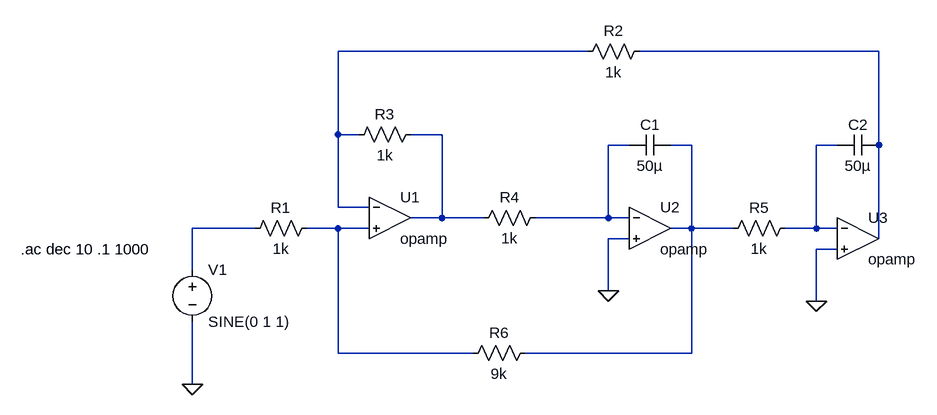
[diagram p0: schematic schem.asc]
schem.asc, the LTspice schematic file:
Version 4
SHEET 1 1240 680
WIRE 224 -96 -160 -96
WIRE 672 -96 304 -96
WIRE -160 32 -160 -96
WIRE -128 32 -160 32
WIRE 0 32 -48 32
WIRE 288 48 256 48
WIRE 384 48 352 48
WIRE 608 48 576 48
WIRE 672 48 672 -96
WIRE -160 144 -160 32
WIRE -112 144 -160 144
WIRE 0 160 0 32
WIRE 0 160 -48 160
WIRE 64 160 0 160
WIRE 256 160 256 48
WIRE 256 160 144 160
WIRE 288 160 256 160
WIRE -288 176 -384 176
WIRE -160 176 -208 176
WIRE -112 176 -160 176
WIRE 384 176 384 48
WIRE 384 176 352 176
WIRE 448 176 384 176
WIRE 576 176 576 48
WIRE 576 176 528 176
WIRE 608 176 576 176
WIRE 288 192 256 192
WIRE 672 192 672 48
WIRE 608 208 576 208
WIRE -384 240 -384 176
WIRE 256 272 256 192
WIRE 576 288 576 208
WIRE -160 368 -160 176
WIRE 48 368 -160 368
WIRE 384 368 384 176
WIRE 384 368 128 368
WIRE -384 416 -384 320
FLAG 576 288 0
FLAG 256 272 0
FLAG -384 416 0
SYMBOL Opamps\\opamp -80 96 R0
SYMATTR InstName U1
SYMBOL Opamps\\opamp 320 112 R0
SYMATTR InstName U2
SYMBOL Opamps\\opamp 640 128 R0
SYMATTR InstName U3
SYMBOL res -192 160 R90
WINDOW 0 0 56 VBottom 2
WINDOW 3 32 56 VTop 2
SYMATTR InstName R1
SYMATTR Value 1k
SYMBOL res 320 -112 R90
WINDOW 0 0 56 VBottom 2
WINDOW 3 32 56 VTop 2
SYMATTR InstName R2
SYMATTR Value 1k
SYMBOL res -32 16 R90
WINDOW 0 0 56 VBottom 2
WINDOW 3 32 56 VTop 2
SYMATTR InstName R3
SYMATTR Value 1k
SYMBOL res 160 144 R90
WINDOW 0 0 56 VBottom 2
WINDOW 3 32 56 VTop 2
SYMATTR InstName R4
SYMATTR Value 1k
SYMBOL res 544 160 R90
WINDOW 0 0 56 VBottom 2
WINDOW 3 32 56 VTop 2
SYMATTR InstName R5
SYMATTR Value 1k
SYMBOL res 144 352 R90
WINDOW 0 0 56 VBottom 2
WINDOW 3 32 56 VTop 2
SYMATTR InstName R6
SYMATTR Value 9k
SYMBOL cap 352 32 R90
WINDOW 0 0 32 VBottom 2
WINDOW 3 32 32 VTop 2
SYMATTR InstName C1
SYMATTR Value 50µ
SYMBOL cap 672 32 R90
WINDOW 0 0 32 VBottom 2
WINDOW 3 32 32 VTop 2
SYMATTR InstName C2
SYMATTR Value 50µ
SYMBOL voltage -384 224 R0
WINDOW 123 0 0 Left 2
WINDOW 39 0 0 Left 2
SYMATTR InstName V1
SYMATTR Value SINE(0 1 1)
TEXT -648 208 Left 2 !.ac dec 10 .1 1000

The netlist it stands for:
* schem.asc
XU1 N001 N008 N003 opamp Aol=100K GBW=10Meg  ; pins invin noninvin out
XU2 N004 0 N005 opamp Aol=100K GBW=10Meg  ; pins invin noninvin out
XU3 N006 0 N002 opamp Aol=100K GBW=10Meg  ; pins invin noninvin out
R1 N008 N007 1k
R2 N002 N001 1k
R3 N003 N001 1k
R4 N004 N003 1k
R5 N006 N005 1k
R6 N005 N008 9k
C1 N005 N004 50µ
C2 N002 N006 50µ
V1 N007 0 SINE(0 1 1)
.ac dec 10 .1 1000
.backanno
.end